# EAGLE schematic Project3 (EAGLE 9.2.2)
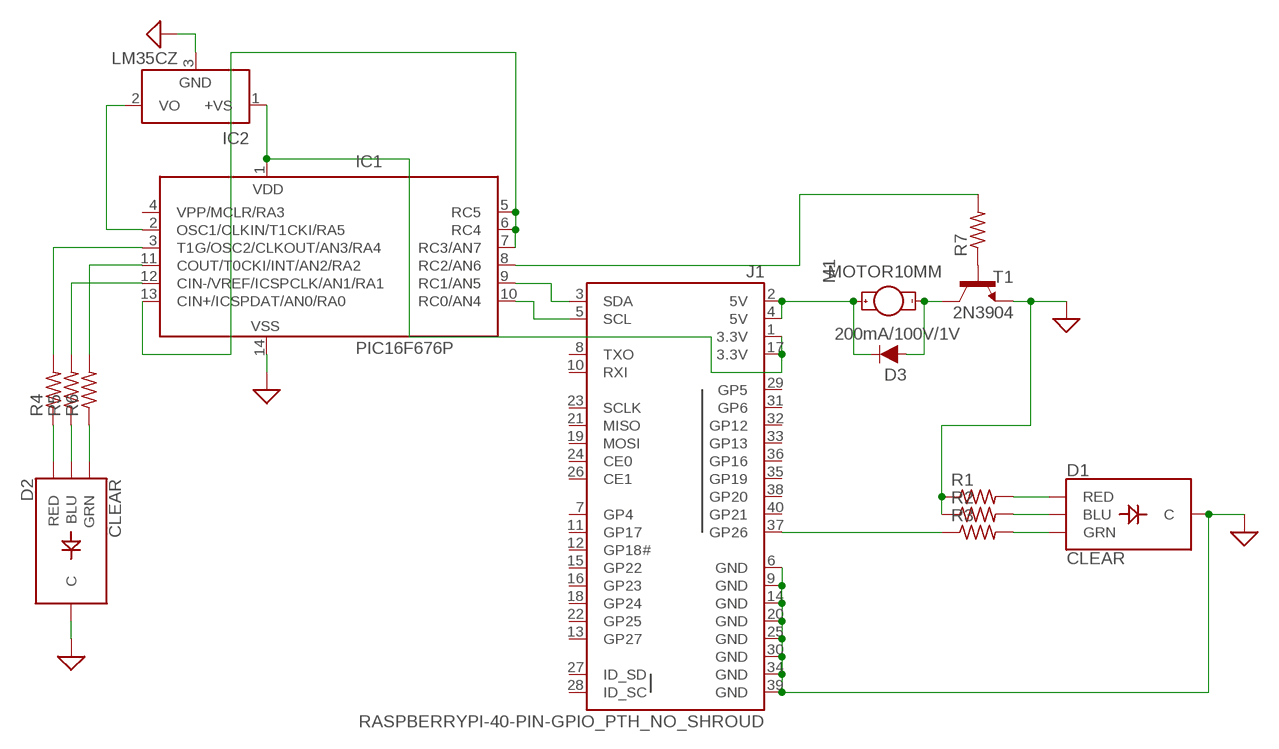
[diagram p0: schematic, sheet 1]

## Parts
D1  CLEAR  LED-RGB-CCCLEAR  [LED-RGB-THRU]
D2  CLEAR  LED-RGB-CCCLEAR  [LED-RGB-THRU]
D3  200mA/100V/1V  DIODE-1N4148  [DIODE-1N4148]
IC1  PIC16F676P  [DIL14]
IC2  LM35CZ  [TO92]
J1  RASPBERRYPI-40-PIN-GPIO_PTH_NO_SHROUD  [2X20]
M1  MOTOR10MM  [VIBE-MOTOR-10MM]
R1  R-US_0204/2V  [0204V]
R2  R-US_0204/2V  [0204V]
R3  R-US_0204/2V  [0204V]
R4  R-US_0204/2V  [0204V]
R5  R-US_0204/2V  [0204V]
R6  R-US_0204/2V  [0204V]
R7  R-US_0204/2V  [0204V]
T1  2N3904  [TO92]

## Nets
GND: D1.2(C) D2.2(C) IC1.14(VSS) IC2.3(GND) J1.6(GND) J1.9(GND) J1.14(GND) J1.20(GND) J1.25(GND) J1.30(GND) J1.34(GND) J1.39(GND) R1.1 R2.1 T1.3(E) ; supply symbol labelled SUP
N$1: D3.C J1.2(5V) J1.4(5V) M1.+
N$2: D3.A M1.- T1.1(C)
N$3: IC1.10(RC0/AN4) J1.5(SCL)
N$4: IC1.9(RC1/AN5) J1.3(SDA)
N$5: R7.1 T1.2(B)
N$6: IC1.2(OSC1/CLKIN/T1CKI/RA5) IC2.2(VO)
N$7: IC1.1(VDD) IC2.1(+VS) J1.1(3.3V) J1.17(3.3V)
N$8: IC1.8(RC2/AN6) R7.2
N$9: IC1.5(RC5) IC1.6(RC4) IC1.7(RC3/AN7) IC1.13(CIN+/ICSPDAT/AN0/RA0)
N$10: IC1.3(T1G/OSC2/CLKOUT/AN3/RA4) R4.2
N$11: D2.1(RED) R4.1
N$12: D2.4(BLU) R5.1
N$13: IC1.11(COUT/T0CKI/INT/AN2/RA2) R6.2
N$14: IC1.12(CIN-/VREF/ICSPCLK/AN1/RA1) R5.2
N$15: D2.3(GRN) R6.1
N$16: J1.37(GP26) R3.1
N$17: D1.3(GRN) R3.2
N$18: D1.4(BLU) R2.2
N$19: D1.1(RED) R1.2
Unconnected: IC1.4(VPP/MCLR/RA3) J1.7(GP4) J1.8(TXO) J1.10(RXI) J1.11(GP17) J1.12(GP18#) J1.13(GP27) J1.15(GP22) J1.16(GP23) J1.18(GP24) J1.19(MOSI) J1.21(MISO) J1.22(GP25) J1.23(SCLK) J1.24(CE0) J1.26(CE1) J1.27(ID_SD) J1.28(ID_SC) J1.29(GP5) J1.31(GP6) J1.32(GP12) J1.33(GP13) J1.35(GP19) J1.36(GP16) J1.38(GP20) J1.40(GP21)

## Library data of the parts
D1 D2 = SparkFun-LED:LED-RGB-CC: LED-RGB Common Cathode Packages: LED RGB-THRU LED_PIRANHA_5MM SparkFun Products: RGB Diffused Common Cathode- Diffuse <[https://www.sparkfun.com/products/9264]> RGB Diffused Common Cathode - Clear <[https://www.sparkfun.com/products/105]> LED-RGB 5mm Square (Piranha) <[https://www.sparkfun.com/products/11679]>; PROD_ID: DIO-08418
D3 = SparkFun-DiscreteSemi:DIODE: Diode These are standard reverse protection diodes and small signal diodes. SparkFun Products: SparkFun SparkPunk Sound Kit <https://www.sparkfun.com/products/11177> SparkFun ESP8266 Thing <https://www.sparkfun.com/products/13231>; PROD_ID: DIO-08378
IC1 = microchip:PIC16F676: 14-Pin, Flash-Based 8-Bit CMOS Microcontroller High Performance RISC CPU: * Only 35 instructions to learn - All single-cycle instructions except branches * Operating speed: - DC - 20 MHz oscillator/clock input - DC - 200 ns instruction cycle * Internal and external oscillator options - Precision Internal 4 MHz oscillator factory calibrated to ±1% - External Oscillator support for crystals and resonators - 5?s wake-up from SLEEP, 3.0V, typical * Power saving SLEEP mode * Wide operating voltage range - 2.0V to 5.5V * Industrial and Extended temperature range * Low power Power-on Reset (POR) * Power-up Timer (PWRT) and Oscillator Start-up Timer (OST) * Brown-out Detect (BOD) * Watchdog Timer (WDT) with independent oscillator for reliable operation * Multiplexed MCLR/Input-pin * Interrupt-on-pin change * Individual programmable weak pull-ups * Programmable code protection * High Endurance FLASH/EEPROM Cell - 100,000 write FLASH endurance - 1,000,000 write EEPROM endurance - FLASH/Data EEPROM Retention: > 40 years * Standby Current: - 1 nA @ 2.0V, typical * Operating Current: - 8.5?A @ 32 kHz, 2.0V, typical - 100?A @ 1 MHz, 2.0V, typical * Watchdog Timer Current - 300 nA @ 2.0V, typical * Timer1 oscillator current: - 4?A @ 32 kHz, 2.0V, typical * 12 I/O pins with individual direction control * High current sink/source for direct LED drive * Analog-to-Digital Converter module (PIC16F676): - 10-bit resolution - Programmable 8-channel input - Voltage reference input * In-Circuit Serial ProgrammingTM (ICSPTM) via two pins Source: http://ww1.microchip.com/downloads/en/DeviceDoc/40039E.pdf; MF: MICROCHIP; MPN: PIC16F676-I/P; OC_FARNELL: 9760512; OC_NEWARK: 54K2829
IC2 = lm35:LM35: Single-Supply Centigrade Temperature Sensor Vout = (10mV/°C x Temp °C) +5mmmV Source: http://www.national.com/ds/LM/LM35.pdf
J1 = SparkFun-Connectors:RASPBERRYPI-40-PIN-GPIO: Raspberry Pi GPIO Header 2x20 pin connector, as found on B, B+, A+ models. Both shrouded PTH and SMT versions available. SparkFun Products: GPIO Shrouded Header <https://www.sparkfun.com/products/13054>- PTH SparkFun Pi Wedge (Preassembled) <https://www.sparkfun.com/products/13717>
M1 = SparkFun-Electromechanical:MOTOR: Motor (Single-Phase) Two-terminal, single-phase motors. SparkFun Products Vibration Motor <https://www.sparkfun.com/products/8449> (ROB-08449) Physical dimension and wire connections for this powerful vibration motor. Motor has a self adhesive backing.; PROD_ID: COMP-08572; SF_SKU: ROB-08449
R1-R7 = rcl:R-US_: RESISTOR, American symbol; SPICEPREFIX: R
T1 = transistor:2N3904: NPN TRANSISTOR